# EasyEDA schematic Tesseract_Motherboard.json
TITLE: LED Cube - Controller; REV: 3.4; Date: 2023-10-04; Sheet: 1/1; Drawn By: Déňa; Company: The Automation Warehouse
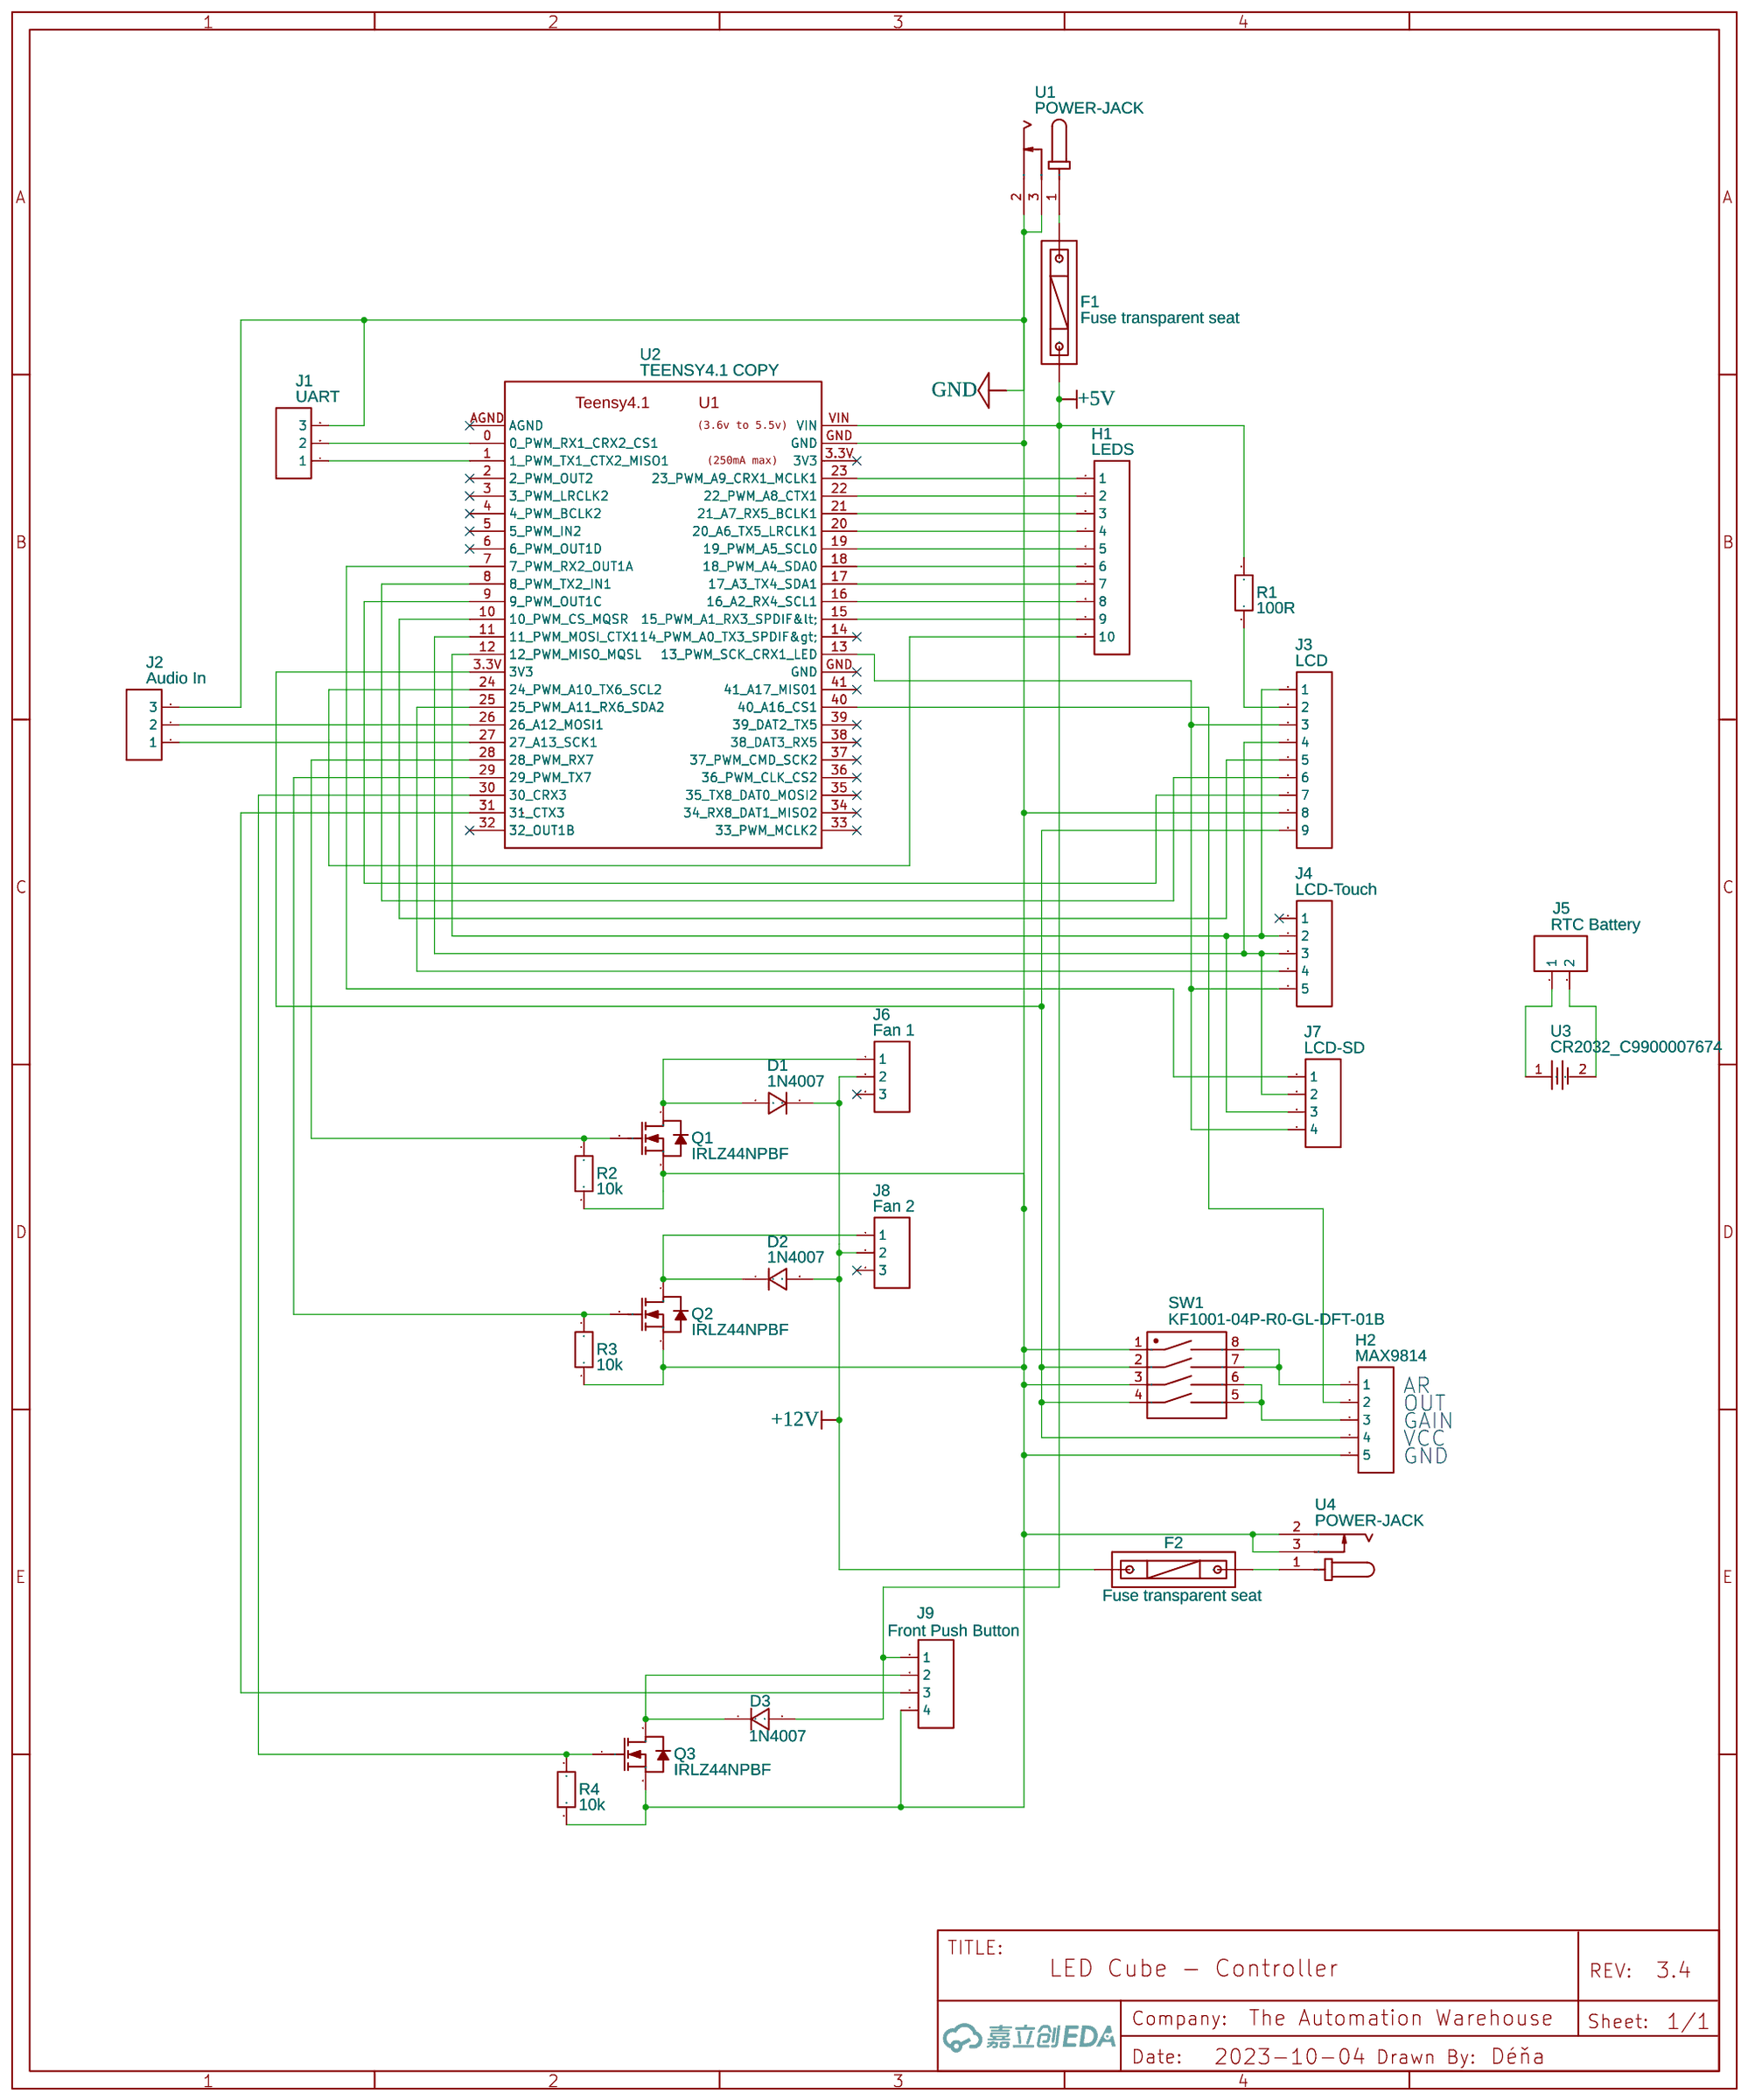
[diagram p0: schematic sheet]

## Parts
D1  1N4007  [DO-41_BD2.4-L4.7-P8.70-D0.9-RD]
D2  1N4007  [DO-41_BD2.4-L4.7-P8.70-D0.9-RD]
D3  1N4007  [DO-41_BD2.4-L4.7-P8.70-D0.9-RD]
F1  Fuse transparent seat  [FUSE-TH_L24.5-W9.8-P22.5]
F2  Fuse transparent seat  [FUSE-TH_L24.5-W9.8-P22.5]
H1  LEDS  [HDR-F-2.54_1X10]
H2  MAX9814  [HDR-F-2.54_1X5]
J1  UART  [HDR-M-2.54_1X3]
J2  Audio In  [HDR-M-2.54_1X3]
J3  LCD  [HDR-M-2.54_1X9]
J4  LCD-Touch  [HDR-M-2.54_1X5]
J5  RTC Battery  [HDR-M-2.54_1X2]
J6  Fan 1  [HDR-M-2.54_1X3]
J7  LCD-SD  [HDR-M-2.54_1X4]
J8  Fan 2  [HDR-M-2.54_1X3]
J9  Front Push Button  [HDR-M-2.54_1X4]
Q1  IRLZ44NPBF  [TO-220-3_L10.0-W4.5-P2.54-T]
Q2  IRLZ44NPBF  [TO-220-3_L10.0-W4.5-P2.54-T]
Q3  IRLZ44NPBF  [TO-220-3_L10.0-W4.5-P2.54-T]
R1  100R  [R_AXIAL-0.3]
R2  10k  [R_AXIAL-0.3]
R3  10k  [R_AXIAL-0.3]
R4  10k  [R_AXIAL-0.3]
SW1  KF1001-04P-R0-GL-DFT-01B  [SW-TH_8P-L11.6-W10.0-P2.54-LS7.62]
U1  POWER-JACK  [DC-IN-TH_POWER-JACK]
U2  TEENSY4.1 COPY  [TEENSY4.1]
U3  CR2032_C9900007674  [BAT-TH_CR2032-1]
U4  POWER-JACK  [DC-IN-TH_POWER-JACK]

## Library data of the parts
D1-D3 = 1N4007: Supplier: LCSC; Manufacturer: SEMTECH; Supplier Part: C106903; Contributor: LCEDA_Lib
F1 F2 = Fuse transparent seat: Supplier: LCSC; Manufacturer: xcfuse(旭程); Supplier Part: C58066; JLCPCB Part Class: Extended Part
H1 = HDR-F-2.54_1x10: Supplier Part: C35445; Supplier: LCSC; Contributor: LCEDA_Lib
H2 = HDR-F-2.54_1x5: Supplier Part: C50950; Supplier: LCSC; Contributor: LCEDA_Lib
J1 J2 J6 J8 = HDR-M-2.54_1x3: Supplier Part: C180248; Supplier: LCSC; Contributor: LCEDA_Lib
J3 = HDR-M-2.54_1x9: Supplier Part: C225484; Supplier: LCSC; Contributor: LCEDA_Lib
J4 = HDR-M-2.54_1x5: Supplier Part: C358687; Supplier: LCSC; Contributor: LCEDA_Lib
J5 = HDR-M-2.54_1x2: Supplier Part: C124375; Supplier: LCSC; Contributor: LCEDA_Lib
J7 J9 = HDR-M-2.54_1x4: Supplier Part: C124378; Supplier: LCSC; Contributor: LCEDA_Lib
Q1-Q3 = IRLZ44NPBF: Supplier: LCSC; Manufacturer: Infineon(英飞凌); Supplier Part: C38774; JLCPCB Part Class: Extended Part
R1-R4 = R_AXIAL-0.4_EU: Contributor: LCEDA_Lib
SW1 = KF1001-04P-R0-GL-DFT-01B: Contributor: LCSC; Supplier: LCSC; Supplier Part: C976326; Manufacturer: 凯峰; JLCPCB Part Class: Extended Part
U1 U4 = POWER-JACK: Supplier: LCSC; Supplier Part: C9900001795; Manufacturer: null; JLCPCB Part Class: Extended Part; Contributor: LCSC
U2 = TEENSY4.1 COPY: Manufacturer: PJRC; Manufacturer Part: Teensy4.1; link: https://www.pjrc.com/store/teensy41.html; Contributor: laserline2000
U3 = CR2032_C9900007674: Contributor: lcsc; Supplier: LCSC; Supplier Part: C9900007674; Manufacturer: null; JLCPCB Part Class: Extended Part

## Nets
+5V: D3.2 F1.1 J9.1 R1.2 U2.VIN
+12V: D1.1 D2.2 F2.1 J6.2 J8.2
GND: H2.5 J1.3 J2.3 J3.8 J9.4 Q1.3(S) Q2.3(S) Q3.3(S) R2.1 R3.1 R4.1 SW1.1 SW1.3 U1.2 U1.3 U2.GND U4.2 U4.3
Net-(D1-2): D1.2 J6.1 Q1.2(D)
Net-(D2-1): D2.1 J8.1 Q2.2(D)
Net-(D3-1): D3.1 J9.2 Q3.2(D)
Net-(F1-2): F1.2 U1.1
Net-(F2-2): F2.2 U4.1
Net-(H1-1): H1.1 U2.23(23_PWM_A9_CRX1_MCLK1)
Net-(H1-2): H1.2 U2.22(22_PWM_A8_CTX1)
Net-(H1-3): H1.3 U2.21(21_A7_RX5_BCLK1)
Net-(H1-4): H1.4 U2.20(20_A6_TX5_LRCLK1)
Net-(H1-5): H1.5 U2.19(19_PWM_A5_SCL0)
Net-(H1-6): H1.6 U2.18(18_PWM_A4_SDA0)
Net-(H1-7): H1.7 U2.17(17_A3_TX4_SDA1)
Net-(H1-8): H1.8 U2.16(16_A2_RX4_SCL1)
Net-(H1-9): H1.9 U2.15(15_PWM_A1_RX3_SPDIF<)
Net-(H1-10): H1.10 U2.24(24_PWM_A10_TX6_SCL2)
Net-(H2-1): H2.1 SW1.7(8) SW1.8(9)
Net-(H2-2): H2.2 U2.40(40_A16_CS1)
Net-(H2-3): H2.3 SW1.5(6) SW1.6(7)
Net-(H2-4): H2.4 J3.9 SW1.2 SW1.4 U2.3.3V(3V3)
Net-(J1-1): J1.1 U2.1(1_PWM_TX1_CTX2_MISO1)
Net-(J1-2): J1.2 U2.0(0_PWM_RX1_CRX2_CS1)
Net-(J2-1): J2.1 U2.27(27_A13_SCK1)
Net-(J2-2): J2.2 U2.26(26_A12_MOSI1)
Net-(J3-1): J3.1 J4.2 J7.3 U2.12(12_PWM_MISO_MQSL)
Net-(J3-2): J3.2 R1.1
Net-(J3-3): J3.3 J4.5 J7.4 U2.13(13_PWM_SCK_CRX1_LED)
Net-(J3-4): J3.4 J4.3 J7.2 U2.11(11_PWM_MOSI_CTX1)
Net-(J3-5): J3.5 U2.10(10_PWM_CS_MQSR)
Net-(J3-6): J3.6 U2.8(8_PWM_TX2_IN1)
Net-(J3-7): J3.7 U2.9(9_PWM_OUT1C)
Net-(J4-4): J4.4 U2.25(25_PWM_A11_RX6_SDA2)
Net-(J5-1): J5.1 U3.1
Net-(J5-2): J5.2 U3.2
Net-(J7-1): J7.1 U2.7(7_PWM_RX2_OUT1A)
Net-(J9-3): J9.3 U2.31(31_CTX3)
Net-(Q1-1): Q1.1(G) R2.2 U2.28(28_PWM_RX7)
Net-(Q2-1): Q2.1(G) R3.2 U2.29(29_PWM_TX7)
Net-(Q3-1): Q3.1(G) R4.2 U2.30(30_CRX3)

Not connected (* = marked no-connect by the designer): J4 1*; J6 3*; J8 3*; U2 2(2_PWM_OUT2)* 3(3_PWM_LRCLK2)* 4(4_PWM_BCLK2)* 5(5_PWM_IN2)* 6(6_PWM_OUT1D)* 14(14_PWM_A0_TX3_SPDIF>)* 32(32_OUT1B)* 33(33_PWM_MCLK2)* 34(34_RX8_DAT1_MISO2)* 35(35_TX8_DAT0_MOSI2)* 36(36_PWM_CLK_CS2)* 37(37_PWM_CMD_SCK2)* 38(38_DAT3_RX5)* 39(39_DAT2_TX5)* 41(41_A17_MIS01)* AGND*

## Notes on the sheet
- AR
- GAIN
- OUT
- VCC
- GND
